# Altium project Matician.PrjPcb
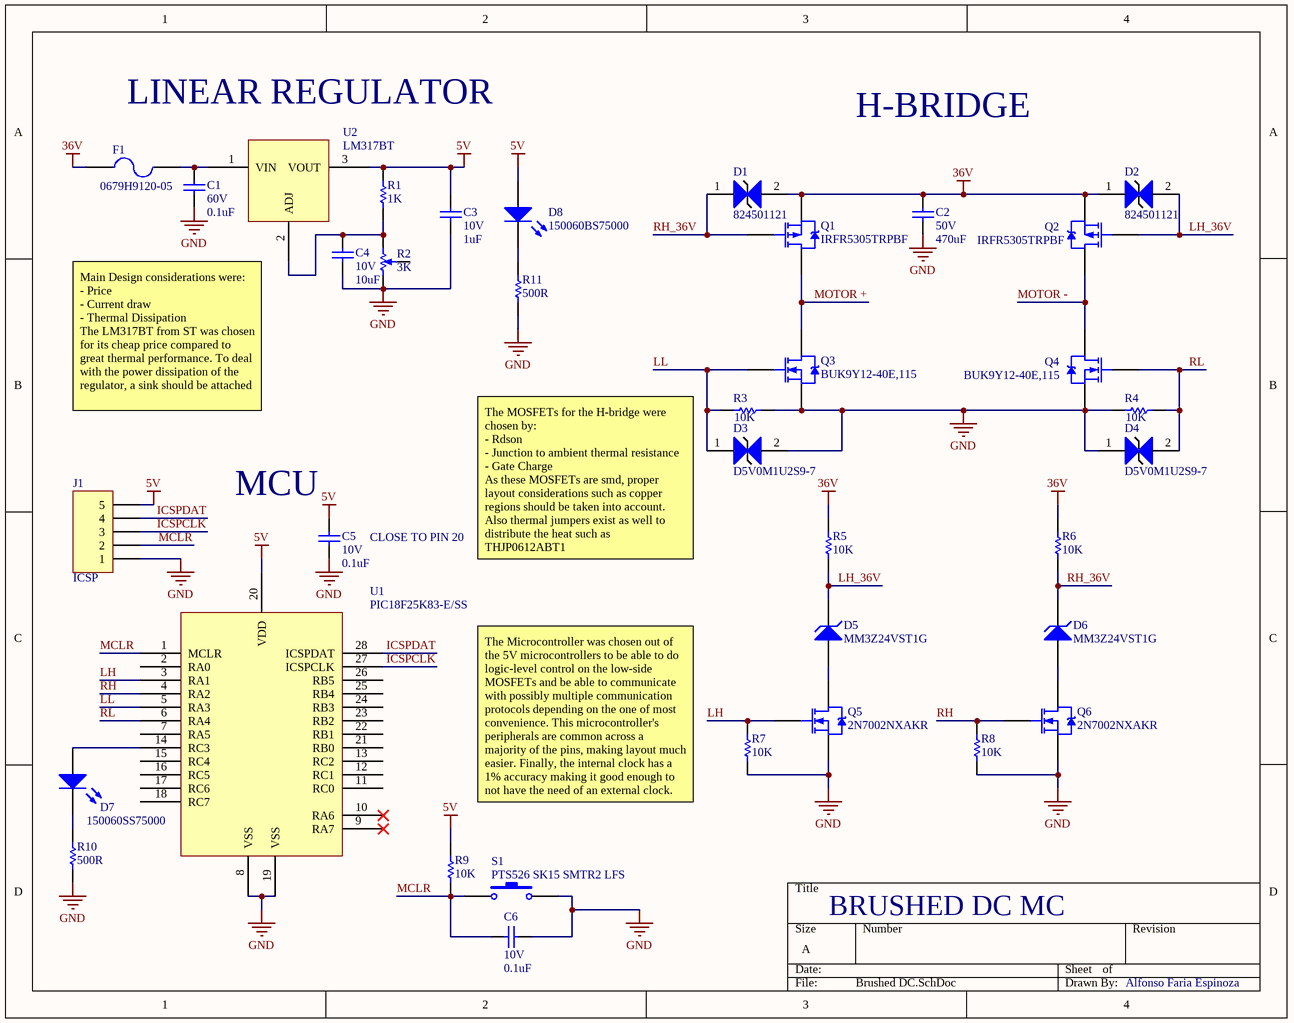
[diagram p0: Brushed DC.SchDoc]
1 sheet, 36 parts. Net scope: global (net labels, ports and power ports of the same name join across sheets).

## Sheet Brushed DC.SchDoc: Brushed DC Motor Controller
size A; Author: Alfonso Faria Espinoza; DrawnBy: Alfonso Faria Espinoza

### Parts
C1  60V  value 0.1uF  [RAD-0.3]
C2  50V  value 470uF  [RAD-0.3]
C3  10V  value 1uF  [RAD-0.3]
C4  10V  value 10uF  [RAD-0.3]
C5  10V  value 0.1uF  [RAD-0.3]
C6  10V  value 0.1uF  [RAD-0.3]
D1  824501121
D2  824501121
D3  D5V0M1U2S9-7
D4  D5V0M1U2S9-7
D5  MM3Z24VST1G  [DIODE-0.7]
D6  MM3Z24VST1G  [DIODE-0.7]
D7  150060SS75000  [LED-0]
D8  150060BS75000  [LED-0]
F1  0679H9120-05  [PIN-W2/E2.8]
J1  ICSP  [HDR1X5]
Q1  IRFR5305TRPBF  [TO-220AB]
Q2  IRFR5305TRPBF  [TO-220AB]
Q3  BUK9Y12-40E,115  [TO-220AB]
Q4  BUK9Y12-40E,115  [TO-220AB]
Q5  2N7002NXAKR  [TO-220AB]
Q6  2N7002NXAKR  [TO-220AB]
R1  value 1K  [AXIAL-0.3]  (hidden comment: Res1)
R2  3K  [POT4MM-2]
R3  value 10K  [AXIAL-0.3]  (hidden comment: Res1)
R4  value 10K  [AXIAL-0.3]  (hidden comment: Res1)
R5  value 10K  [AXIAL-0.3]  (hidden comment: Res1)
R6  value 10K  [AXIAL-0.3]  (hidden comment: Res1)
R7  value 10K  [AXIAL-0.3]  (hidden comment: Res1)
R8  value 10K  [AXIAL-0.3]  (hidden comment: Res1)
R9  value 10K  [AXIAL-0.3]  (hidden comment: Res1)
R10  value 500R  [AXIAL-0.3]  (hidden comment: Res1)
R11  value 500R  [AXIAL-0.3]  (hidden comment: Res1)
S1  PTS526 SK15 SMTR2 LFS  [SPST-2]
U1  PIC18F25K83-E/SS
U2  LM317BT

### Nets
5V: C3.2 C5.2 D8.1(A) J1.5 R1.2 R9.2 U1.20(VDD) U2.3(VOUT)
36V: C2.2 D1.2 D2.1 F1.1 Q1.3(S) Q2.3(S) R5.2 R6.2
GND: C1.1 C2.1 C3.1 C4.1 C5.1 C6.1 D3.2 D4.1 J1.1 Q3.3(S) Q4.3(S) Q5.3(S) Q6.3(S) R2.CCW(-) R3.2 R4.1 R7.1 R8.1 R10.1 R11.1 S1.2 U1.8(VSS) U1.19(VSS)
ICSPCLK: J1.3 U1.27(ICSPCLK)
ICSPDAT: J1.4 U1.28(ICSPDAT)
LH: Q5.1(G) R7.2 U1.3(RA1)
LH_36V: D2.2 D5.2(K) Q2.1(G) R5.1
LL: D3.1 Q3.1(G) R3.1 U1.5(RA3)
MCLR: C6.2 J1.2 R9.1 S1.1 U1.1(MCLR)
MOTOR +: Q1.2(D) Q3.2(D)
MOTOR -: Q2.2(D) Q4.2(D)
RH: Q6.1(G) R8.2 U1.4(RA2)
RH_36V: D1.1 D6.2(K) Q1.1(G) R6.1
RL: D4.2 Q4.1(G) R4.2 U1.6(RA4)
NetC1_2: C1.2 F1.2 U2.1(VIN)
NetC4_2: C4.2 R1.1 R2.CW(+) U2.2(ADJ)
NetD5_1: D5.1(A) Q5.2(D)
NetD6_1: D6.1(A) Q6.2(D)
NetD7_1: D7.1(A) U1.14(RC3)
NetD7_2: D7.2(K) R10.2
NetD8_2: D8.2(K) R11.2

Not connected (* = marked no-connect by the designer): R2 W; U1 2(RA0) 7(RA5) 9(RA7)* 10(RA6)* 11(RC0) 12(RC1) 13(RC2) 15(RC4) 16(RC5) 17(RC6) 18(RC7) 21(RB0) 22(RB1) 23(RB2) 24(RB3) 25(RB4) 26(RB5)

### Notes on the sheet
- LINEAR REGULATOR
- H-BRIDGE
- (near U2) Main Design considerations were:
  - Price
  - Current draw
  - Thermal Dissipation
  The LM317BT from ST was chosen for its cheap price compared to great thermal performance. To deal with the power dissipation of the regulator, a sink should be attached
- (near C5) MCU
- (near C5) CLOSE TO PIN 20
- The MOSFETs for the H-bridge were chosen by:
  - Rdson
  - Junction to ambient thermal resistance
  - Gate Charge
  As these MOSFETs are smd, proper layout considerations such as copper regions should be taken into account. Also thermal jumpers exist as well to distribute the heat such as THJP0612ABT1
- The Microcontroller was chosen out of the 5V microcontrollers to be able to do logic-level control on the low-side MOSFETs and be able to communicate with possibly multiple communication protocols depending on the one of most convenience. This microcontroller's peripherals are common across a majority of the pins, making layout much easier. Finally, the internal clock has a 1% accuracy making it good enough to not have the need of an external clock.
- BRUSHED DC MC
- Alfonso Faria Espinoza

### Library data of the parts
C1-C6 = Cap: Capacitor; Published: 8-Jun-2000; LatestRevisionDate: 17-Jul-2002; LatestRevisionNote: Re-released for DXP Platform.; PackageReference: RAD-0.3; Publisher: Altium Limited; PackageDescription: Radial Cap, Thru-Hole; 2 Leads; 0.3 in Pin Spacing
D1-D4 = TVS
D5 D6 = D Zener: Zener Diode; Published: 8-Jun-2000; LatestRevisionDate: 17-Jul-2002; LatestRevisionNote: Re-released for DXP Platform.; PackageReference: DIODE-0.7; Publisher: Altium Limited; PackageDescription: Diode, Thru-Hole; 2 Leads; 0.7 in Pin Spacing
D7 D8 = LED0: Typical INFRARED GaAs LED; Published: 8-Jun-2000; LatestRevisionDate: 08-Jul-2005; LatestRevisionNote: Mech Layer 1 removed.; PackageReference: LED-0; Publisher: Altium Limited; PackageDescription: LED; 2 Leads
F1 = Fuse 2: Fuse; Published: 8-Jun-2000; LatestRevisionDate: 17-Jul-2002; LatestRevisionNote: Re-released for DXP Platform.; PackageReference: PIN-W2/E2.8; Publisher: Altium Limited; PackageDescription: Thru-Hole; 2 Leads
J1 = Header 5: Header, 5-Pin; LatestRevisionDate: 17-Jul-2002; LatestRevisionNote: Re-released for DXP Platform.; Publisher: Altium Limited
Q1 Q2 = PMOS-2: P-Channel Power MOSFET; Note: Pin 4 not drawn and electrically connected to Pin 2.; Published: 8-Jun-2000; LatestRevisionDate: 17-Jul-2002; LatestRevisionNote: Re-released for DXP Platform.; DatasheetVersion: PD-9.390D; PackageVersion: Feb-1997; PackageReference: TO-220AB; Publisher: Altium Limited; PackageDescription: TO, Thru-Hole, Vertical, Heatsink Mounted; 3 In-Line Leads; Pitch 2.54 mm; ComponentLink1Description: Manufacturer Link; ComponentLink1URL: http://www.irf.com/
Q3-Q6 = NMOS-2: N-Channel Power MOSFET; Note: Pin 2 is electrically connected to pin 4.; Published: 8-Jun-2000; LatestRevisionDate: 17-Jul-2002; LatestRevisionNote: Re-released for DXP Platform.; DatasheetVersion: PD-9.814; PackageVersion: Feb-1997; PackageReference: TO-220AB; Publisher: Altium Limited; PackageDescription: TO, Thru-Hole, Vertical, Heatsink Mounted; 3 In-Line Leads; Pitch 2.54 mm; ComponentLink1Description: Manufacturer Link; ComponentLink1URL: http://www.irf.com/
R1 R3-R11 = Res1: Resistor; Published: 8-Jun-2000; LatestRevisionDate: 17-Jul-2002; LatestRevisionNote: Re-released for DXP Platform.; PackageReference: AXIAL-0.3; Publisher: Altium Limited; PackageDescription: Axial Device, Thru-Hole; 2 Leads; 0.3 in Pin Spacing
R2 = RPot SM: Square Trimming Potentiometer; Published: 17-Dec-2003; DatasheetVersion: Oct-2003; PackageReference: POT4MM-2; Publisher: Altium Limited; PackageDescription: Square Trimming Potentiometer; ComponentLink1Description: Manufacturer Link; ComponentLink1URL: http://bourns.com/2/search.html
S1 = SW-PB: Switch; Published: 24-Mar-1999; LatestRevisionDate: 17-Jul-2002; LatestRevisionNote: Re-released for DXP Platform.; PackageReference: SPST-2; Publisher: Altium Limited; PackageDescription: Switch; 2 Leads
U1 = PIC18F25K83-E/SS: PIC PIC® XLP™ 18K, Functional Safety (FuSa) Microcontroller IC 8-Bit 64MHz 32KB (16K x 16) FLASH 28-SSOP /
U2 = LM317BT: Linear Voltage Regulator IC 1 Output 1.5A TO-220